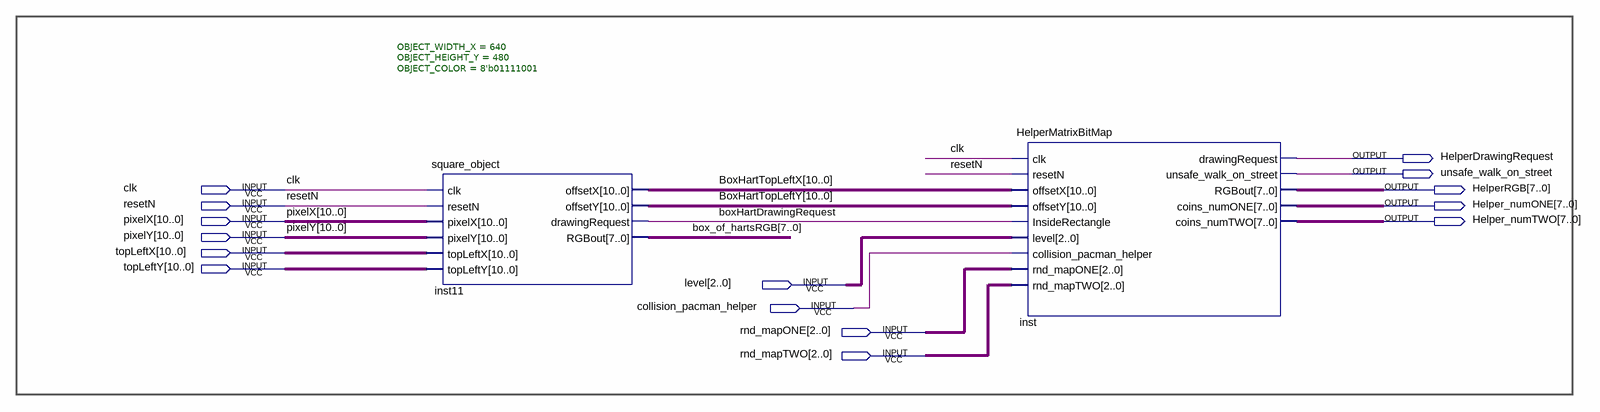
[diagram p0: schematic sheet]
// Quartus schematic HELPER_DISPLAY.bdf as structural Verilog: 2 symbols, 15 pins
module HELPER_DISPLAY (
  input  clk,
  input  resetN,
  input  [10:0] pixelX,
  input  [10:0] pixelY,
  input  [10:0] topLeftX,
  input  [10:0] topLeftY,
  input  [2:0] level,
  input  collision_pacman_helper,
  input  [2:0] rnd_mapONE,
  input  [2:0] rnd_mapTWO,
  output HelperDrawingRequest,
  output unsafe_walk_on_street,
  output [7:0] HelperRGB,
  output [7:0] Helper_numONE,
  output [7:0] Helper_numTWO
);

  wire boxHartDrawingRequest;
  wire [7:0] box_of_hartsRGB;
  wire [10:0] BoxHartTopLeftX, BoxHartTopLeftY;

  square_object #(.OBJECT_WIDTH_X(640), .OBJECT_HEIGHT_Y(480), .OBJECT_COLOR(8'b01111001)) inst11 (
    .clk(clk), .resetN(resetN), .pixelX(pixelX), .pixelY(pixelY), .topLeftX(topLeftX), .topLeftY(topLeftY),
    .offsetX(BoxHartTopLeftX), .offsetY(BoxHartTopLeftY), .drawingRequest(boxHartDrawingRequest),
    .RGBout(box_of_hartsRGB));
  HelperMatrixBitMap inst (
    .clk(clk), .resetN(resetN), .offsetX(BoxHartTopLeftX), .offsetY(BoxHartTopLeftY),
    .InsideRectangle(boxHartDrawingRequest), .level(level),
    .collision_pacman_helper(collision_pacman_helper), .rnd_mapONE(rnd_mapONE), .rnd_mapTWO(rnd_mapTWO),
    .drawingRequest(HelperDrawingRequest), .unsafe_walk_on_street(unsafe_walk_on_street), .RGBout(HelperRGB),
    .coins_numONE(Helper_numONE), .coins_numTWO(Helper_numTWO));
endmodule
